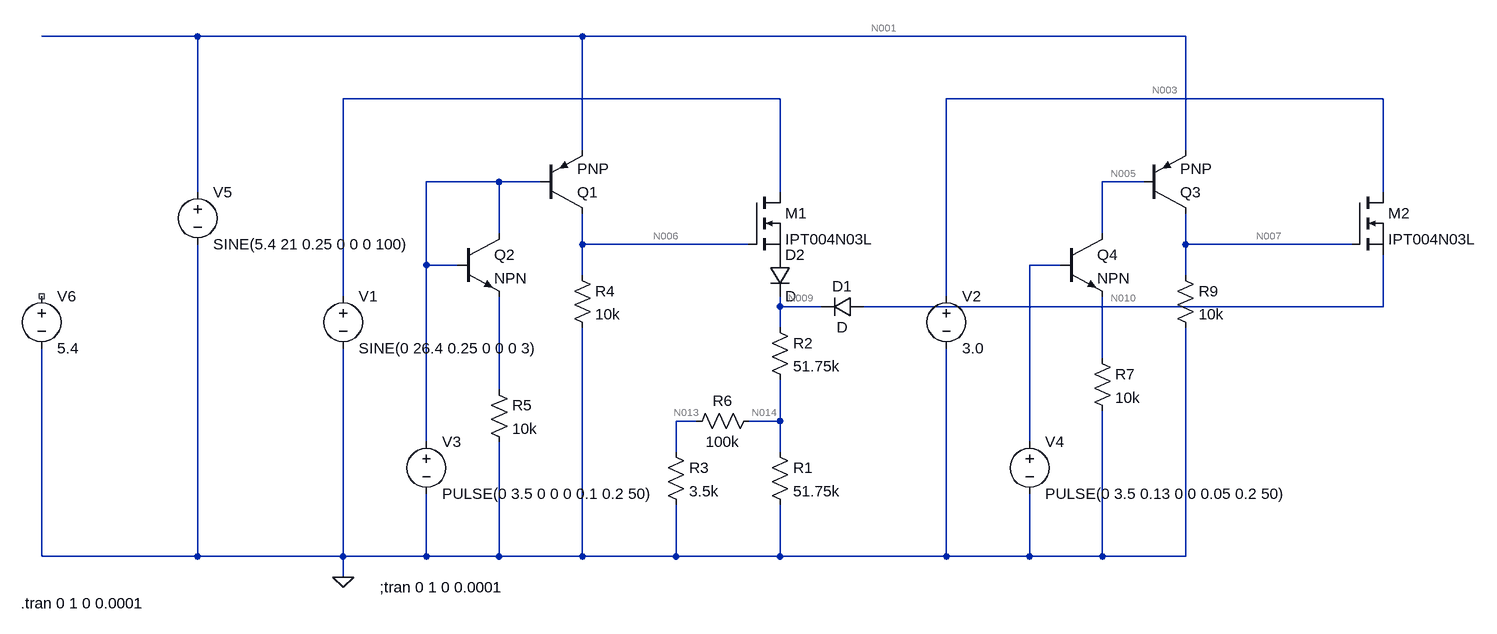
[diagram p0: schematic VoltSampleSim.asc]
VoltSampleSim.asc, the LTspice schematic file:
Version 4
SHEET 1 1572 680
WIRE -704 -304 -944 -304
WIRE -112 -304 -704 -304
WIRE 816 -304 -112 -304
WIRE 192 -208 -480 -208
WIRE 1120 -208 448 -208
WIRE -112 -128 -112 -304
WIRE 816 -128 816 -304
WIRE -240 -80 -352 -80
WIRE -176 -80 -240 -80
WIRE 752 -80 688 -80
WIRE -704 -64 -704 -304
WIRE 192 -64 192 -208
WIRE 1120 -64 1120 -208
WIRE -240 0 -240 -80
WIRE 688 0 688 -80
WIRE -112 16 -112 -32
WIRE 144 16 -112 16
WIRE 816 16 816 -32
WIRE 1072 16 816 16
WIRE -352 48 -352 -80
WIRE -304 48 -352 48
WIRE 624 48 576 48
WIRE -112 64 -112 16
WIRE 816 64 816 16
WIRE -480 96 -480 -208
WIRE 448 96 448 -208
WIRE 192 112 192 96
WIRE 256 112 192 112
WIRE 1120 112 1120 32
WIRE 1120 112 320 112
WIRE 192 144 192 112
WIRE 688 192 688 96
WIRE -240 240 -240 96
WIRE 64 288 32 288
WIRE 192 288 192 224
WIRE 192 288 144 288
WIRE -352 320 -352 48
WIRE 576 320 576 48
WIRE 32 336 32 288
WIRE 192 336 192 288
WIRE -944 496 -944 176
WIRE -704 496 -704 16
WIRE -704 496 -944 496
WIRE -480 496 -480 176
WIRE -480 496 -704 496
WIRE -352 496 -352 400
WIRE -352 496 -480 496
WIRE -240 496 -240 320
WIRE -240 496 -352 496
WIRE -112 496 -112 144
WIRE -112 496 -240 496
WIRE 32 496 32 416
WIRE 32 496 -112 496
WIRE 192 496 192 416
WIRE 192 496 32 496
WIRE 448 496 448 176
WIRE 448 496 192 496
WIRE 576 496 576 400
WIRE 576 496 448 496
WIRE 688 496 688 272
WIRE 688 496 576 496
WIRE 816 496 816 144
WIRE 816 496 688 496
WIRE -480 528 -480 496
FLAG -480 528 0
SYMBOL voltage -480 80 R0
WINDOW 123 0 0 Left 0
WINDOW 39 0 0 Left 0
SYMATTR InstName V1
SYMATTR Value SINE(0 26.4 0.25 0 0 0 3)
SYMBOL voltage -352 304 R0
WINDOW 123 0 0 Left 0
WINDOW 39 0 0 Left 0
SYMATTR InstName V3
SYMATTR Value PULSE(0 3.5 0 0 0 0.1 0.2 50)
SYMBOL res 176 320 R0
SYMATTR InstName R1
SYMATTR Value 51.75k
SYMBOL res 176 128 R0
SYMATTR InstName R2
SYMATTR Value 51.75k
SYMBOL res 16 320 R0
SYMATTR InstName R3
SYMATTR Value 3.5k
SYMBOL pnp -176 -32 M180
SYMATTR InstName Q1
SYMBOL npn -304 0 R0
SYMATTR InstName Q2
SYMBOL res -128 48 R0
SYMATTR InstName R4
SYMATTR Value 10k
SYMBOL nmos 144 -64 R0
SYMATTR InstName M1
SYMATTR Value IPT004N03L
SYMBOL voltage 448 80 R0
WINDOW 123 0 0 Left 0
WINDOW 39 0 0 Left 0
SYMATTR InstName V2
SYMATTR Value 3.0
SYMBOL voltage 576 304 R0
WINDOW 123 0 0 Left 0
WINDOW 39 0 0 Left 0
SYMATTR InstName V4
SYMATTR Value PULSE(0 3.5 0.13 0 0 0.05 0.2 50)
SYMBOL pnp 752 -32 M180
SYMATTR InstName Q3
SYMBOL npn 624 0 R0
SYMATTR InstName Q4
SYMBOL res 800 48 R0
SYMATTR InstName R9
SYMATTR Value 10k
SYMBOL nmos 1072 -64 R0
SYMATTR InstName M2
SYMATTR Value IPT004N03L
SYMBOL diode 320 96 R90
WINDOW 0 0 32 VBottom 2
WINDOW 3 32 32 VTop 2
SYMATTR InstName D1
SYMBOL diode 176 32 R0
SYMATTR InstName D2
SYMBOL voltage -704 -80 R0
WINDOW 123 0 0 Left 0
WINDOW 39 0 0 Left 0
SYMATTR InstName V5
SYMATTR Value SINE(5.4 21 0.25 0 0 0 100)
SYMBOL voltage -944 80 R0
WINDOW 123 0 0 Left 0
WINDOW 39 0 0 Left 0
SYMATTR InstName V6
SYMATTR Value 5.4
SYMBOL res 160 272 R90
WINDOW 0 0 56 VBottom 2
WINDOW 3 32 56 VTop 2
SYMATTR InstName R6
SYMATTR Value 100k
SYMBOL res -256 224 R0
SYMATTR InstName R5
SYMATTR Value 10k
SYMBOL res 672 176 R0
SYMATTR InstName R7
SYMATTR Value 10k
TEXT -424 544 Left 2 !;tran 0 1 0 0.0001
TEXT -976 568 Left 2 !.tran 0 1 0 0.0001

The netlist it stands for:
* VoltSampleSim.asc
V1 N002 0 SINE(0 26.4 0.25 0 0 0 3)
V3 N004 0 PULSE(0 3.5 0 0 0 0.1 0.2 50)
R1 N014 0 51.75k
R2 N009 N014 51.75k
R3 N013 0 3.5k
Q1 N006 N004 N001 0 PNP
Q2 N004 N004 N012 0 NPN
R4 N006 0 10k
M1 N002 N006 P001 P001 IPT004N03L
V2 N003 0 3.0
V4 N008 0 PULSE(0 3.5 0.13 0 0 0.05 0.2 50)
Q3 N007 N005 N001 0 PNP
Q4 N005 N008 N011 0 NPN
R9 N007 0 10k
M2 N003 N007 N010 N010 IPT004N03L
D1 N010 N009 D
D2 P001 N009 D
V5 N001 0 SINE(5.4 21 0.25 0 0 0 100)
V6 NC_01 0 5.4
R6 N014 N013 100k
R5 N012 0 10k
R7 N011 0 10k
.model D D
.lib standard.dio
.model NPN NPN
.model PNP PNP
.lib standard.bjt
.model NMOS NMOS
.model PMOS PMOS
.lib standard.mos
;tran 0 1 0 0.0001
.tran 0 1 0 0.0001
.backanno
.end

* Results of the author's LTspice run, read from the files saved beside the schematic
* Operating Point, zero values left out:
*   V(n014) = 8.122 µV
*   V(n009) = 20.3 µV
*   V(n013) = 274.7 nV
*   V(n006) = 3.474 V
*   V(n001) = 5.4 V
*   V(n003) = 3 V
*   V(n007) = 9.603 µV
*   V(n005) = 4.984 V
*   V(n010) = 260.4 mV
*   Ic(Q4) = 4.984 pA
*   Ib(Q4) = -4.984 pA
*   Ic(Q3) = -960.3 pA
*   Ib(Q3) = -4.984 pA
*   Ie(Q3) = 965.3 pA
*   Ic(Q1) = -488.3 µA
*   Ib(Q1) = -1.965 TA
*   Ie(Q1) = 1.965 TA
*   Id(M2) = 232.4 pA
*   Is(M2) = -232.4 pA
*   I(D1) = 235.4 pA
*   I(R6) = 78.47 pA
*   I(R9) = 960.3 pA
*   I(R4) = 347.4 µA
*   I(R3) = 78.47 pA
*   I(R2) = 235.4 pA
*   I(R1) = 156.9 pA
*   I(V5) = -1.965 TA
*   I(V4) = 4.984 pA
*   I(V2) = -240.1 pA
*   I(V3) = 1.965 TA
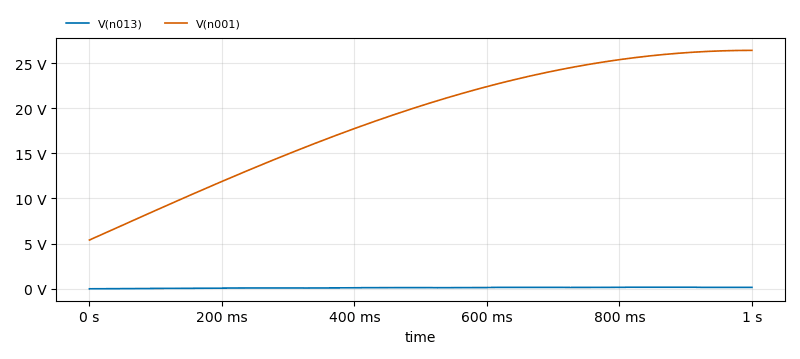
[diagram p1: Transient Analysis of VoltSampleSim.asc, plotted from the saved traces]
* Transient Analysis, 1 run:
*   V(n013): min 274.7 nV, max 180.4 mV, average 116.8 mV, rms 126.6 mV, last 158.3 mV
*   V(n001): min 5.4 V, max 26.4 V, average 18.77 V, rms 19.85 V, last 26.4 V